# EAGLE design cpico_power (EAGLE 6.2)
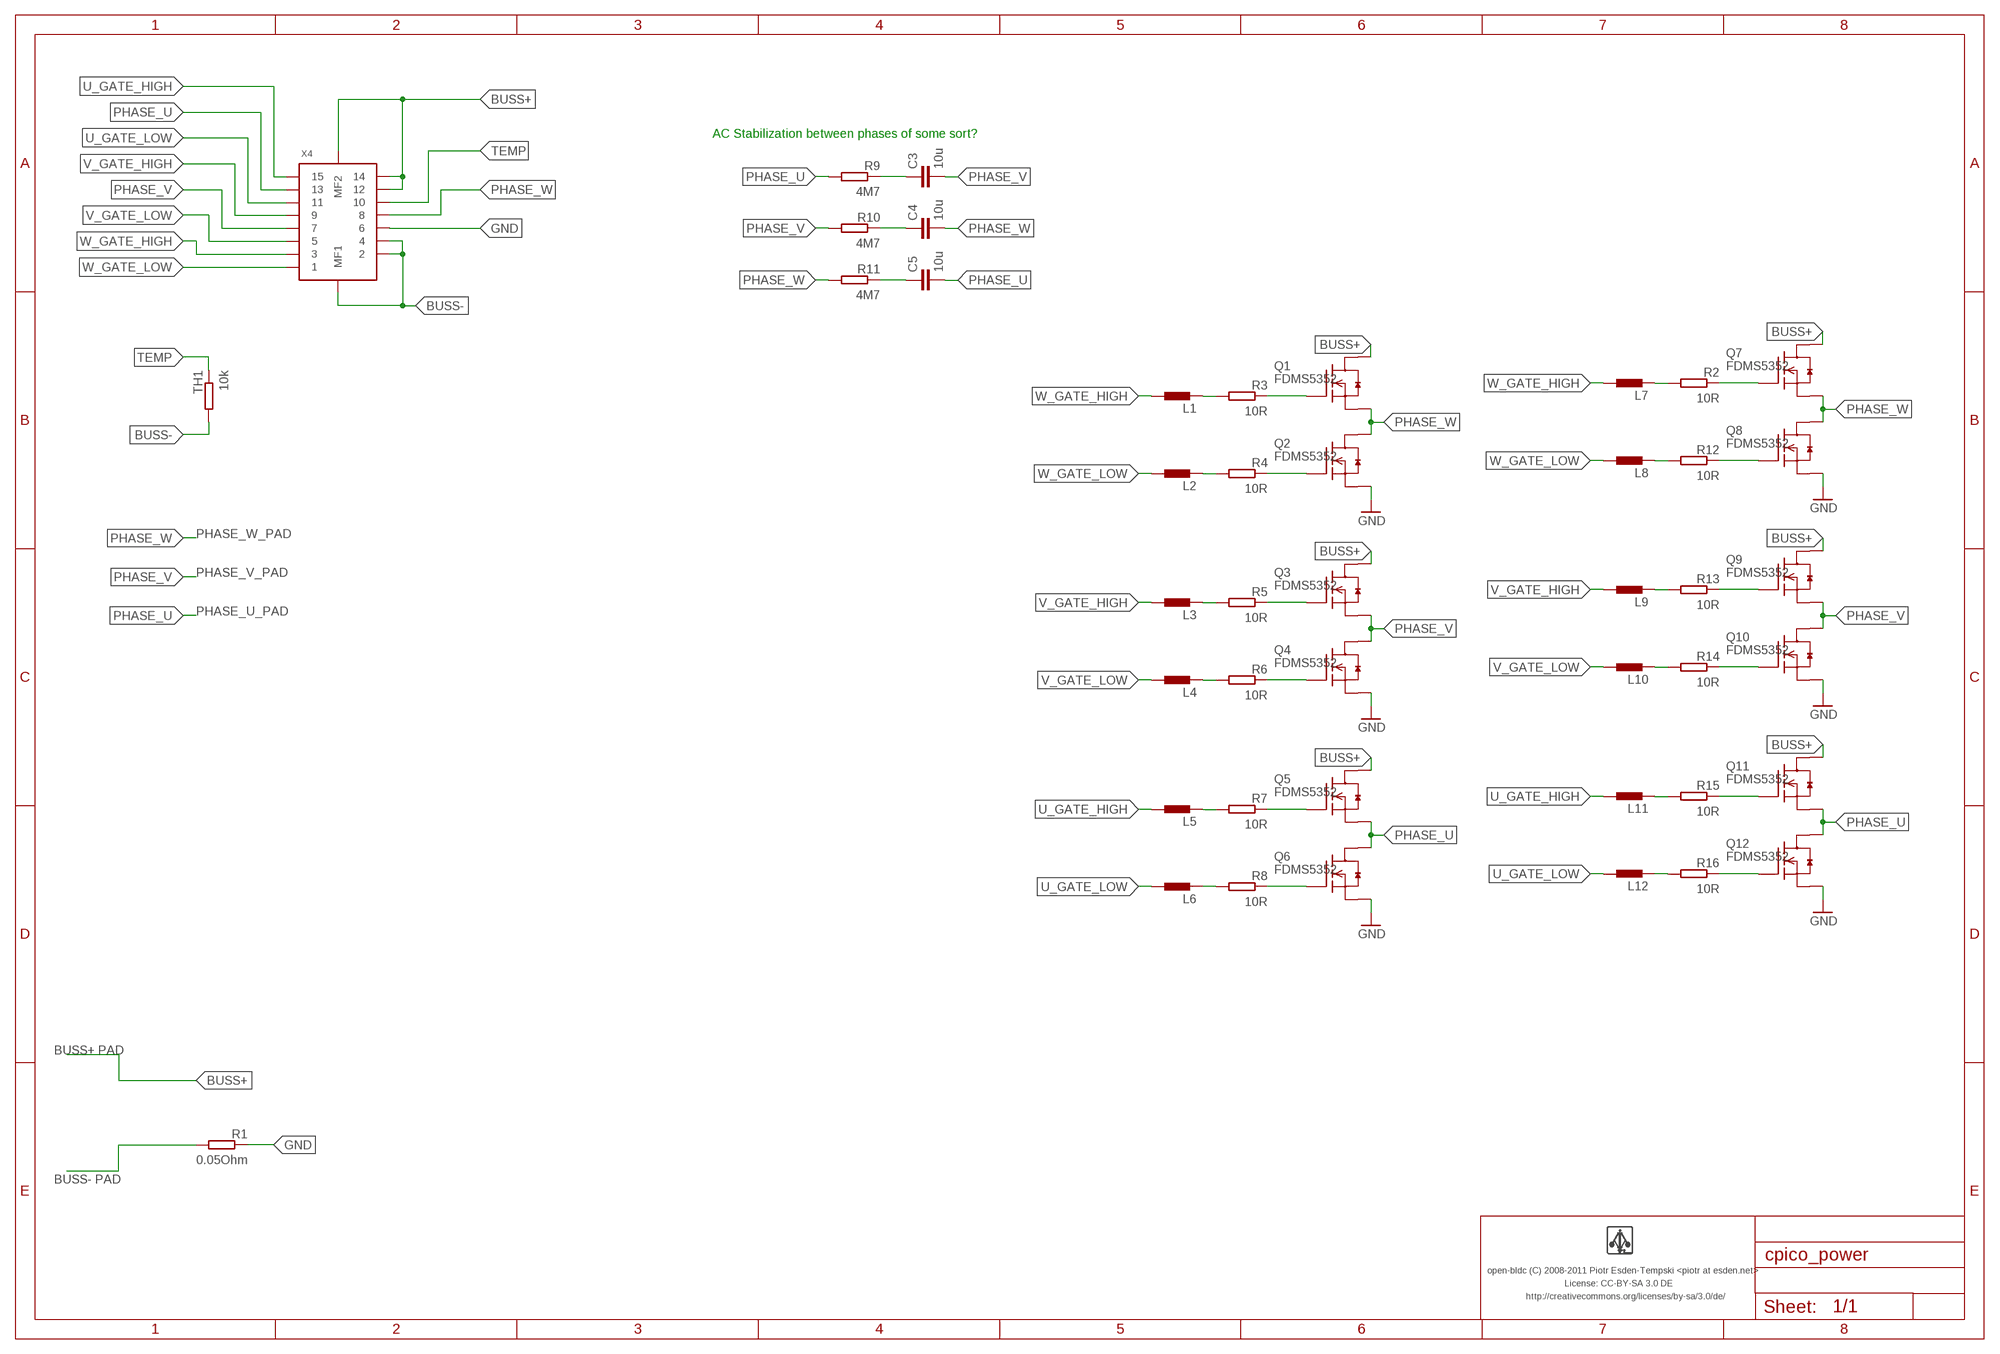
[diagram p0: schematic, sheet 1]

## Parts
C3  10u  CAPACITOR-0603  [0603-CAP]
C4  10u  CAPACITOR-0603  [0603-CAP]
C5  10u  CAPACITOR-0603  [0603-CAP]
L1  INDUCTOR-0402  [0402-IND]
L2  INDUCTOR-0402  [0402-IND]
L3  INDUCTOR-0402  [0402-IND]
L4  INDUCTOR-0402  [0402-IND]
L5  INDUCTOR-0402  [0402-IND]
L6  INDUCTOR-0402  [0402-IND]
L7  INDUCTOR-0402  [0402-IND]
L8  INDUCTOR-0402  [0402-IND]
L9  INDUCTOR-0402  [0402-IND]
L10  INDUCTOR-0402  [0402-IND]
L11  INDUCTOR-0402  [0402-IND]
L12  INDUCTOR-0402  [0402-IND]
Q1  FDMS5352  [MSL1]
Q2  FDMS5352  [MSL1]
Q3  FDMS5352  [MSL1]
Q4  FDMS5352  [MSL1]
Q5  FDMS5352  [MSL1]
Q6  FDMS5352  [MSL1]
Q7  FDMS5352  [MSL1]
Q8  FDMS5352  [MSL1]
Q9  FDMS5352  [MSL1]
Q10  FDMS5352  [MSL1]
Q11  FDMS5352  [MSL1]
Q12  FDMS5352  [MSL1]
R1  0.05Ohm  RESISTOR-1206  [1206-RES]
R2  10R  RESISTOR-0402  [0402-RES]
R3  10R  RESISTOR-0402  [0402-RES]
R4  10R  RESISTOR-0402  [0402-RES]
R5  10R  RESISTOR-0402  [0402-RES]
R6  10R  RESISTOR-0402  [0402-RES]
R7  10R  RESISTOR-0402  [0402-RES]
R8  10R  RESISTOR-0402  [0402-RES]
R9  4M7  RESISTOR-0603  [0603-RES]
R10  4M7  RESISTOR-0603  [0603-RES]
R11  4M7  RESISTOR-0603  [0603-RES]
R12  10R  RESISTOR-0402  [0402-RES]
R13  10R  RESISTOR-0402  [0402-RES]
R14  10R  RESISTOR-0402  [0402-RES]
R15  10R  RESISTOR-0402  [0402-RES]
R16  10R  RESISTOR-0402  [0402-RES]
TH1  10k  RESISTOR-0603  [0603-RES]
U$2  LOGO-NORM  [LOGO]
X4  CONN_15-2-2MT-DF9  [DF9-15]

## Nets
BUSS+: Q1.3(D) Q3.3(D) Q5.3(D) Q7.3(D) Q9.3(D) Q11.3(D) X4.12 X4.14 X4.MF2
BUSS-: R1.P$2 TH1.P$2 X4.2 X4.4 X4.MF1
GND: Q2.1(S) Q4.1(S) Q6.1(S) Q8.1(S) Q10.1(S) Q12.1(S) R1.P$1 X4.6
N$1: Q1.2(G) R3.P$1
N$2: C3.P$1 R9.P$1
N$3: C4.P$1 R10.P$1
N$4: C5.P$1 R11.P$1
N$5: Q2.2(G) R4.P$1
N$6: Q3.2(G) R5.P$1
N$7: Q4.2(G) R6.P$1
N$8: Q5.2(G) R7.P$1
N$9: Q6.2(G) R8.P$1
N$10: L1.P$2 R3.P$2
N$11: L2.P$2 R4.P$2
N$12: L3.P$2 R5.P$2
N$13: L4.P$2 R6.P$2
N$14: L5.P$2 R7.P$2
N$15: L6.P$2 R8.P$2
N$16: L7.P$2 R2.P$2
N$17: L8.P$2 R12.P$2
N$18: L9.P$2 R13.P$2
N$19: L10.P$2 R14.P$2
N$20: L11.P$2 R15.P$2
N$21: L12.P$2 R16.P$2
N$22: Q7.2(G) R2.P$1
N$23: Q8.2(G) R12.P$1
N$24: Q9.2(G) R13.P$1
N$25: Q10.2(G) R14.P$1
N$26: Q11.2(G) R15.P$1
N$27: Q12.2(G) R16.P$1
PHASE_U: C5.P$2 Q5.1(S) Q6.3(D) Q11.1(S) Q12.3(D) R9.P$2 X4.13
PHASE_V: C3.P$2 Q3.1(S) Q4.3(D) Q9.1(S) Q10.3(D) R10.P$2 X4.7
PHASE_W: C4.P$2 Q1.1(S) Q2.3(D) Q7.1(S) Q8.3(D) R11.P$2 X4.8
TEMP: TH1.P$1 X4.10
U_GATE_HIGH: L5.P$1 L11.P$1 X4.15
U_GATE_LOW: L6.P$1 L12.P$1 X4.11
V_GATE_HIGH: L3.P$1 L9.P$1 X4.9
V_GATE_LOW: L4.P$1 L10.P$1 X4.5
W_GATE_HIGH: L1.P$1 L7.P$1 X4.3
W_GATE_LOW: L2.P$1 L8.P$1 X4.1

## Notes on the sheet
- AC Stabilization between phases of some sort?
- PHASE_W_PAD
- PHASE_V_PAD
- PHASE_U_PAD
- BUSS+ PAD
- BUSS- PAD
- open-bldc (C) 2008-2011 Piotr Esden-Tempski <piotr at esden.net>
- License: CC-BY-SA 3.0 DE
- http://creativecommons.org/licenses/by-sa/3.0/de/

## Library data of the parts
C3-C5 = pel_dipol_comp:CAPACITOR
L1-L12 = pel_dipol_comp:INDUCTOR
Q1-Q12 = open-bldc:FDMS5352
R1-R16 TH1 = pel_dipol_comp:RESISTOR
U$2 = open-bldc:LOGO
X4 = open-bldc:CONN_15-2-2MT

## Board
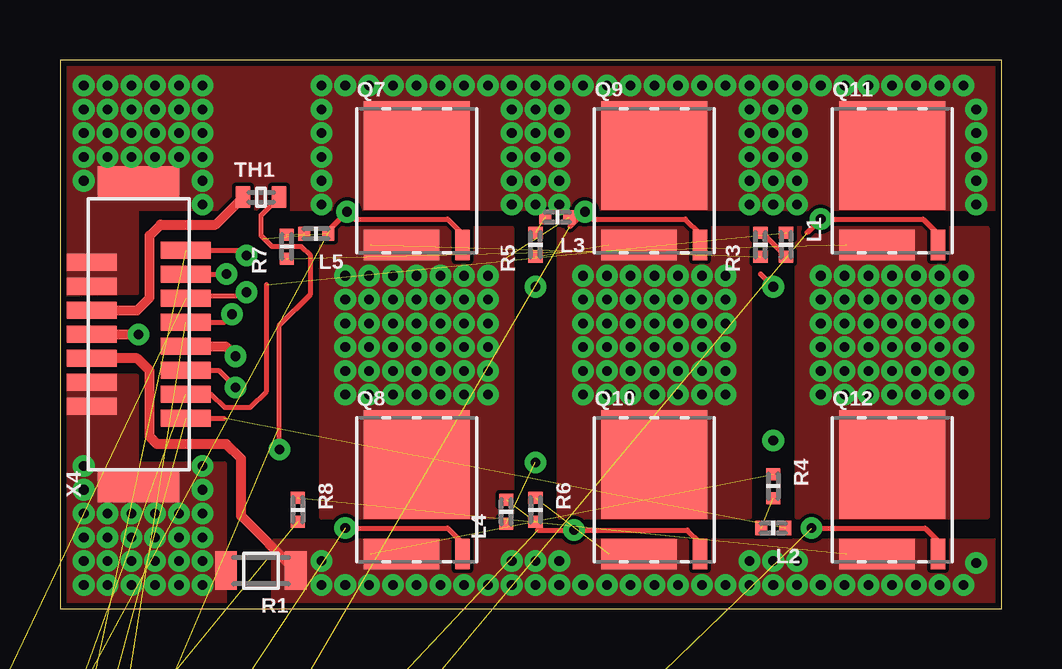
[diagram p1: board, top side]
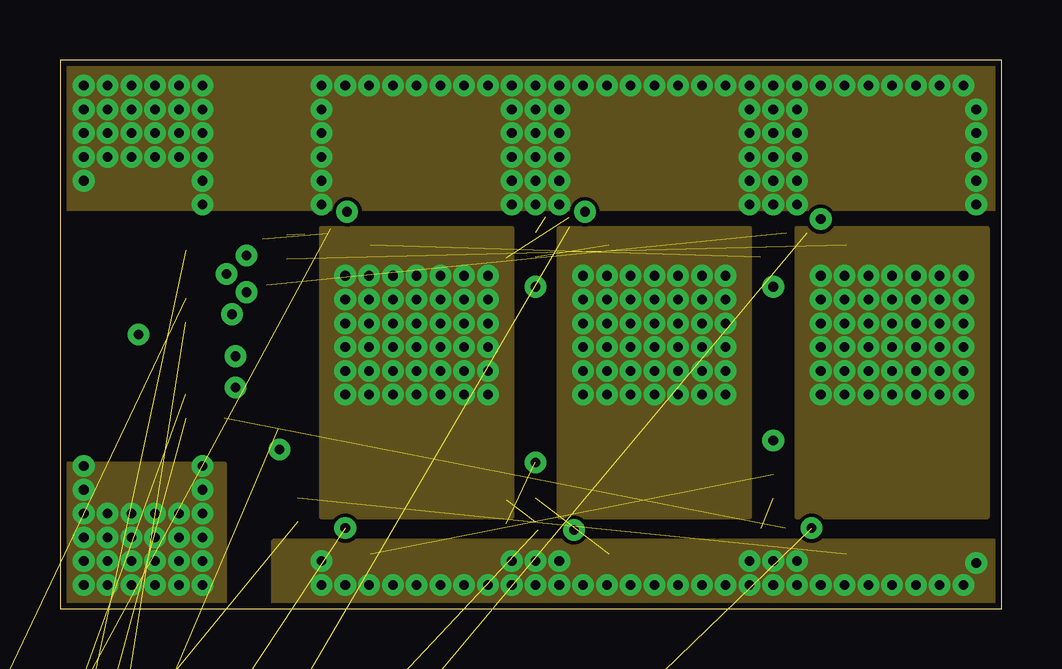
[diagram p2: board, inner layer Route2]
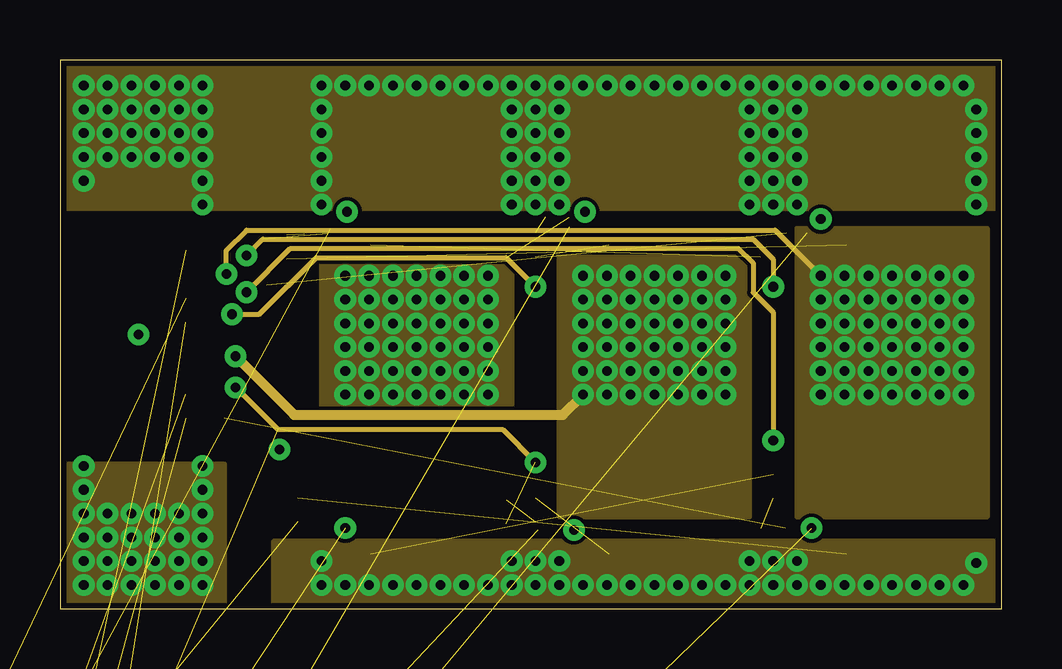
[diagram p3: board, inner layer Route15]
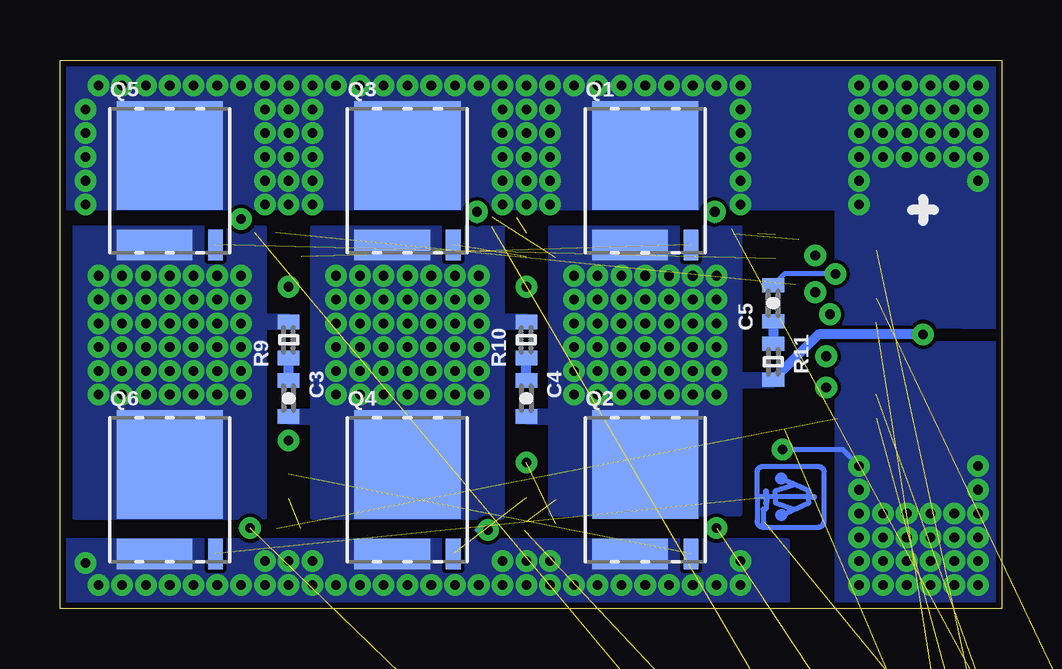
[diagram p4: board, bottom side, seen from below]

Size 39.24 x 22.86 mm. Coordinates in mm from the lower left corner, seen from the top.
Outline: 0,0 39.24,0 39.24,22.86 0,22.86 0,0
Copper layers (1*2+15*16): Top 0.035mm / dielectric 1.5mm / Route2 0.035mm / dielectric 0.15mm / Route15 0.035mm / dielectric 0.2mm / Bottom 0.035mm
Design rules: minimum track width 6mil, minimum drill 0.4mm, track to track 6mil, track to pad 6mil, pad to pad 6mil, via to via 6mil, smd to smd 6mil, copper to edge 10mil, drill to drill 6mil, minimum pad ring 0.25mm, minimum via ring 0.25mm, stop-mask expansion 4mil, vias tented up to drill 0.4mm, thermal gap 10mil

### Footprints (pad centres in the part's own frame; a part is rotated, then mirrored left to right if it is on the bottom)
0603-CAP = smd 0.6 x 0.9: P$1 -0.75,0; P$2 0.75,0
0402-IND = smd 0.5 x 0.6: P$1 -0.5,0; P$2 0.5,0
MSL1 = smd 3.15 x 1.27: 1 -0.635,-2.67 | smd 0.61 x 1.27: 2 1.905,-2.67 | smd 4.42 x 4.52: 3 0,1.045
1206-RES = smd 0.9 x 1.6: P$1 -1.45,0; P$2 1.45,0
0402-RES = smd 0.5 x 0.6: P$1 -0.5,0; P$2 0.5,0
0603-RES = smd 0.6 x 0.9: P$1 -0.75,0; P$2 0.75,0
DF9-15 = smd 0.7 x 2.08: 1 -3.5,-1.96; 2 -3,1.96; 3 -2.5,-1.96; 4 -2,1.96; 5 -1.5,-1.96; 6 -1,1.96; 7 -0.5,-1.96; 8 0,1.96; 9 0.5,-1.96; 10 1,1.96; 11 1.5,-1.96; 12 2,1.96; 13 2.5,-1.96; 14 3,1.96; 15 3.5,-1.96 | smd 1.3 x 3.4: MF1 -6.35,0; MF2 6.35,0

### Placement (x,y rotation side)
C3  29.72,8.76 270 bottom
C4  19.81,8.76 270 bottom
C5  9.53,12.73 90 bottom
L1  30.25,15.16 270 top
L2  29.72,3.35 180 top
L3  20.73,16.31 180 top
L4  18.59,4.04 90 top
L5  10.67,15.62 180 top
L6  -9.83,-19.81 0 top  (outside the outline)
L7  -9.75,-33.83 0 top  (outside the outline)
L8  -5.64,-33.83 0 top  (outside the outline)
L9  -1.52,-33.83 0 top  (outside the outline)
L10  -9.75,-37.95 0 top  (outside the outline)
L11  -5.64,-37.95 0 top  (outside the outline)
L12  -1.52,-37.95 0 top  (outside the outline)
Q1  14.86,17.83 0 bottom
Q2  14.86,4.95 0 bottom
Q3  24.77,17.83 0 bottom
Q4  24.77,4.95 0 bottom
Q5  34.67,17.83 0 bottom
Q6  34.67,4.95 0 bottom
Q7  14.86,17.83 0 top
Q8  14.86,4.95 0 top
Q9  24.77,17.83 0 top
Q10  24.77,4.95 0 top
Q11  34.67,17.83 0 top
Q12  34.67,4.95 0 top
R1  8.37,1.58 180 top
R2  -9.75,-23.93 0 top  (outside the outline)
R3  29.18,15.16 90 top
R4  29.72,5.11 270 top
R5  19.81,15.16 90 top
R6  19.81,4.11 270 top
R7  9.45,15.09 90 top
R8  9.91,4.11 270 top
R9  29.72,11.2 90 bottom
R10  19.81,11.2 90 bottom
R11  9.53,10.29 270 bottom
R12  -5.64,-23.93 0 top  (outside the outline)
R13  -1.52,-23.93 0 top  (outside the outline)
R14  -9.75,-28.88 0 top  (outside the outline)
R15  -5.64,-28.88 0 top  (outside the outline)
R16  -1.52,-28.88 0 top  (outside the outline)
TH1  8.38,17.14 0 top
U$2  8.92,4.67 270 bottom
X4  3.28,11.43 90 top

### Tracks (layer width: path | path; a pad name or v marks a point on that pad's centre or on a via)
BUSS+  (via drill 0.4)
  other vias: 36.65,21.79 37.64,21.79 35.66,21.79 34.67,21.79 33.68,21.79 32.69,21.79 31.7,21.79 28.73,21.79 30.71,21.79 27.74,21.79 26.75,21.79 25.76,21.79 24.77,21.79 23.77,21.79 22.78,21.79 20.8,20.8 20.8,21.79 21.79,21.79 19.81,21.79 18.82,21.79 17.83,21.79 16.84,21.79 15.85,21.79 14.86,21.79 13.87,21.79 12.88,21.79 11.89,21.79 10.9,21.79 29.72,20.8 29.72,19.81 29.72,18.82 29.72,17.83 29.72,16.84 19.81,20.8 19.81,19.81 19.81,18.82 19.81,17.83 19.81,16.84 30.71,20.8 30.71,19.81 30.71,18.82 30.71,17.83 30.71,16.84 28.73,16.84 28.73,17.83 28.73,18.82 28.73,19.81 28.73,20.8 38.18,19.81 38.18,20.8 20.8,16.84 10.9,20.8 29.72,21.79 20.8,19.81 20.8,18.82 20.8,17.83 18.82,16.84 18.82,17.83 18.82,18.82 18.82,19.81 18.82,20.8 38.18,18.82 38.18,17.83 38.18,16.84 10.9,19.81 10.9,18.82 10.9,17.83 10.9,16.84 0.99,21.79 0.99,20.8 0.99,19.81 0.99,18.82 0.99,17.83 1.98,21.79 2.97,21.79 3.96,21.79 4.95,21.79 4.95,20.8 4.95,19.81 4.95,18.82 3.96,18.82 2.97,18.82 1.98,18.82 1.98,19.81 1.98,20.8 2.97,20.8 3.96,20.8 3.96,19.81 2.97,19.81 5.94,16.84 5.94,17.83 5.94,18.82 5.94,19.81 5.94,20.8 5.94,21.79
  pour Bottom (no thermals): 39.24,16.69 39.24,22.86 0,22.86 0,11.73 6.86,11.81 6.86,16.69
  pour Top (no thermals): 39.24,16.69 39.24,22.86 0,22.86 0,13.11 3.2,13.18 3.2,16.69
  pour Route15 (no thermals): 39.24,16.76 39.24,22.86 19.35,16.76
  pour Route2 (no thermals): 39.24,16.76 39.24,22.94 19.35,16.76
  pour Route15: 0,22.86 0,16.69 39.24,16.69 39.24,22.86
  pour Route2: 0,22.86 0,16.69 39.24,16.69 39.24,22.86
BUSS-  (via drill 0.4)
  Top 0.203: TH1.P$2 8.38,16.39 8.38,15.54 8.84,15.09 10.06,15.09 10.44,14.71 10.44,13.11 9.14,11.81 v9.14,6.63
  Bottom 0.203: v5.94,5.94 6.63,6.63 v9.14,6.63
  other vias: 0.99,0.99 1.98,0.99 2.97,0.99 3.96,0.99 4.95,0.99 5.94,0.99 0.99,1.98 1.98,1.98 2.97,1.98 3.96,1.98 4.95,1.98 5.94,1.98 0.99,2.97 1.98,2.97 2.97,2.97 3.96,2.97 4.95,2.97 5.94,2.97 0.99,3.96 1.98,3.96 2.97,3.96 3.96,3.96 4.95,3.96 5.94,3.96 0.99,4.95 5.94,4.95 0.99,5.94
  pour Top (no thermals): 0,0 6.86,0 6.86,6.02 3.2,6.02 3.2,9.68 0,9.68
  pour Route15 (no thermals): 0,0 6.86,0 6.86,6.02 0,6.02
  pour Route2 (no thermals): 0,0 6.86,0 6.86,6.02 0,6.02
  pour Bottom (no thermals): 0,0 6.86,0 6.86,11.05 0,11.05
GND  (via drill 0.4)
  Top 0.406: X4.6 3.21,10.43 3.73,9.91 3.73,7.16 4.04,6.86 6.93,6.86 7.54,6.25 7.54,3.86 R1.P$1
  other vias: 38.18,1.91 37.64,0.99 36.65,0.99 35.66,0.99 34.67,0.99 33.68,0.99 32.69,0.99 31.7,0.99 30.71,0.99 29.72,0.99 29.72,1.98 28.73,0.99 28.73,1.98 27.74,0.99 26.75,0.99 24.77,0.99 25.76,0.99 23.77,0.99 22.78,0.99 20.8,0.99 20.8,1.98 19.81,0.99 19.81,1.98 18.82,0.99 18.82,1.98 17.83,0.99 16.84,0.99 15.85,0.99 14.86,0.99 21.79,0.99 30.71,1.98 13.87,0.99 12.88,0.99 11.89,0.99 10.9,0.99 10.9,1.98
  pour Bottom (no thermals): 39.17,2.82 39.17,0 8.92,0 8.92,2.82
  pour Route15 (no thermals): 39.17,2.82 39.17,0 8.92,0 8.92,2.82
  pour Top (no thermals): 39.17,2.82 39.17,0 8.92,0 8.92,2.82
  pour Route2 (no thermals): 39.17,2.82 39.17,0.08 8.92,0 8.92,2.82
N$1  (1 unrouted)
N$2
  Bottom 0.406: C3.P$1 R9.P$1
N$3
  Bottom 0.406: C4.P$1 R10.P$1
N$4
  Bottom 0.406: C5.P$1 R11.P$1
N$5  (1 unrouted)
N$6  (1 unrouted)
N$7  (1 unrouted)
N$8  (1 unrouted)
N$9  (1 unrouted)
N$10
  Top 0.203: R3.P$2 29.25,15.66 L1.P$2
N$11  (1 unrouted)
N$12  (1 unrouted)
N$13  (1 unrouted)
N$14  (1 unrouted)
N$15  (1 unrouted)
N$16  (1 unrouted)
N$17  (1 unrouted)
N$18  (1 unrouted)
N$19  (1 unrouted)
N$20  (1 unrouted)
N$21  (1 unrouted)
N$22  (via drill 0.4)  (1 unrouted)
  Top 0.203: Q7.2 16.76,15.62 16.15,16.23 12.27,16.23 v11.96,16.54 11.27,15.84
  Bottom 0.203: v11.96,16.54 11.96,16.15
N$23  (via drill 0.4)  (1 unrouted)
  Top 0.203: Q8.2 16.76,2.74 16.15,3.35 v11.89,3.35 11.88,3.37
  Bottom 0.203: v11.89,3.35
N$24  (via drill 0.4)  (1 unrouted)
  Top 0.203: Q9.2 26.67,15.62 26.06,16.23 22.17,16.23 v21.87,16.54 21.25,15.91
  Bottom 0.203: v21.87,16.54 21.87,16.15
N$25  (via drill 0.4)  (1 unrouted)
  Top 0.203: Q10.2 26.67,2.74 26.14,3.28 v21.41,3.28 19.9,3.28
  Bottom 0.203: v21.41,3.28 21.87,3.28
N$26  (via drill 0.4)  (1 unrouted)
  Top 0.203: Q11.2 36.58,15.62 35.97,16.23 v31.7,16.23 31.13,15.66
  Bottom 0.203: v31.7,16.23
N$27  (via drill 0.4)  (1 unrouted)
  Top 0.203: Q12.2 36.58,2.82 36.04,3.35 v31.32,3.35 31.31,3.37
  Bottom 0.203: v31.32,3.35 31.7,3.35
PHASE_U  (via drill 0.4)
  Top 0.203: X4.13 v6.92,13.93
  Top 0.406: v6.92,13.93 v6.93,13.95
  Route15 0.203: v6.93,13.95 6.93,14.94 7.77,15.77 29.79,15.77 v31.7,13.87
  Bottom 0.203: v6.93,13.95 9.06,13.95 C5.P$2
  other vias: 32.69,13.87 33.68,13.87 34.67,13.87 35.66,13.87 36.65,13.87 37.64,13.87 31.7,12.88 32.69,12.88 33.68,12.88 34.67,12.88 35.66,12.88 36.65,12.88 37.64,12.88 31.7,11.89 32.69,11.89 33.68,11.89 34.67,11.89 35.66,11.89 36.65,11.89 37.64,11.89 31.7,10.9 32.69,10.9 33.68,10.9 34.67,10.9 35.66,10.9 36.65,10.9 37.64,10.9 31.7,9.91 32.69,9.91 33.68,9.91 34.67,9.91 35.66,9.91 36.65,9.91 37.64,9.91 31.7,8.92 32.69,8.92 33.68,8.92 34.67,8.92 35.66,8.92 36.65,8.92 37.64,8.92
  pour Top (no thermals): 30.71,15.85 38.63,15.85 38.63,3.81 30.71,3.81
  pour Bottom (no thermals): 30.71,15.85 38.63,15.85 38.63,3.81 30.71,3.81 30.71,11.73 29.72,11.73 29.72,12.19 30.71,12.19
  pour Route15 (no thermals): 30.71,15.85 38.63,15.85 38.63,3.81 30.71,3.81
  pour Route2 (no thermals): 30.71,15.85 38.63,15.85 38.63,3.81 30.71,3.81
PHASE_V  (via drill 0.4)
  Top 0.406: X4.7 6.9,10.93 v7.32,10.52
  Route15 0.406: v7.32,10.52 9.75,8.08 20.95,8.08 v21.79,8.91
  other vias: 21.79,13.87 22.78,13.87 23.77,13.87 24.77,13.87 25.76,13.87 26.75,13.87 27.74,13.87 21.79,12.88 22.78,12.88 23.77,12.88 24.77,12.88 25.76,12.88 26.75,12.88 27.74,12.88 21.79,11.89 22.78,11.89 23.77,11.89 24.77,11.89 25.76,11.89 26.75,11.89 27.74,11.89 21.79,10.9 22.78,10.9 23.77,10.9 24.77,10.9 25.76,10.9 26.75,10.9 27.74,10.9 21.79,9.91 22.78,9.91 23.77,9.91 24.77,9.91 25.76,9.91 26.75,9.91 27.74,9.91 22.78,8.92 23.77,8.92 24.77,8.92 25.76,8.92 26.75,8.92 27.74,8.92
  pour Top (no thermals): 20.8,15.85 28.73,15.85 28.73,3.81 20.8,3.81
  pour Bottom (no thermals): 20.8,15.85 28.73,15.85 28.73,8.23 29.72,8.23 29.72,7.77 28.73,7.77 28.73,3.81 20.8,3.81 20.8,11.73 19.81,11.73 19.81,12.19 20.8,12.19
  pour Route15 (no thermals): 20.8,15.85 28.73,15.85 28.73,3.81 20.8,3.81
  pour Route2 (no thermals): 20.8,15.85 28.73,15.85 28.73,3.81 20.8,3.81
PHASE_W  (via drill 0.4)
  Top 0.406: X4.8 v3.28,11.43
  Bottom 0.406: v3.28,11.43 7.63,11.43 R11.P$2
  other vias: 12.88,13.87 13.87,13.87 14.86,13.87 15.85,13.87 16.84,13.87 16.84,12.88 16.84,11.89 16.84,10.9 16.84,9.91 16.84,8.92 15.85,8.92 14.86,8.92 13.87,8.92 12.88,8.92 12.88,9.91 12.88,10.9 12.88,11.89 12.88,12.88 13.87,12.88 13.87,11.89 13.87,10.9 13.87,9.91 14.86,9.91 15.85,9.91 15.85,10.9 15.85,11.89 15.85,12.88 14.86,12.88 14.86,11.89 14.86,10.9 17.83,13.87 17.83,12.88 17.83,11.89 17.83,10.9 17.83,9.91 17.83,8.92 11.89,8.92 11.89,9.91 11.89,10.9 11.89,11.89 11.89,12.88 11.89,13.87
  pour Bottom (no thermals): 10.9,15.85 18.82,15.85 18.82,8.23 19.81,8.23 19.81,7.77 18.82,7.77 18.82,3.96 10.9,3.96 10.9,9.3 9.53,9.3 9.53,9.75 10.9,9.75
  pour Top (no thermals): 10.9,15.85 18.82,15.85 18.82,3.81 10.9,3.81
  pour Route15 (no thermals): 10.9,15.85 18.82,15.85 18.82,3.81 10.9,3.81
  pour Route2 (no thermals): 10.9,15.85 18.82,15.85 18.82,3.81 10.9,3.81
TEMP
  Top 0.406: X4.10 3.21,12.43 3.73,12.95 3.73,15.54 4.19,16 6.49,16 TH1.P$1
U_GATE_HIGH  (via drill 0.4)  (2 unrouted)
  Top 0.203: v7.77,14.71 7.55,14.93 X4.15 | v29.72,13.41 29.18,13.95
  Route15 0.203: v29.72,13.41 29.72,14.55 28.88,15.39 8.46,15.39 v7.77,14.71
U_GATE_LOW  (via drill 0.4)  (2 unrouted)
  Top 0.203: v7.77,13.18 7.62,13.03 5.34,13.03 X4.11
  Route15 0.203: v29.72,7.01 29.72,12.34 28.88,13.18 28.88,14.4 28.27,15.01 9.6,15.01 v7.77,13.18
V_GATE_HIGH  (via drill 0.4)  (2 unrouted)
  Top 0.203: v7.16,12.27 6.83,11.93 X4.9
  Route15 0.203: v19.81,13.41 18.59,14.63 10.67,14.63 8.31,12.27 v7.16,12.27
V_GATE_LOW  (via drill 0.4)  (2 unrouted)
  Top 0.203: v7.32,9.22 6.61,9.93 X4.5
  Route15 0.203: v19.81,6.1 18.44,7.47 9.07,7.47 v7.32,9.22
W_GATE_HIGH  (2 unrouted)
  Top 0.203: 8.61,13.5 8.61,9.07 7.92,8.38 6.86,8.38 6.31,8.93 X4.3
W_GATE_LOW  (2 unrouted)
  Top 0.203: X4.1 6.84,7.93

### Text on the board
Bottom: CPICO_POWER V0.1 | OPEN-BLDC | CC-BY-SA | (C) 2011 ESDEN
bStop: CPICO_POWER V0.1 | OPEN-BLDC | CC-BY-SA | (C) 2011 ESDEN